# EAGLE design heat_bed_100 (EAGLE 7.2.0)
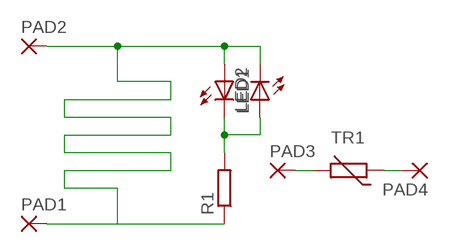
[diagram p0: schematic, sheet 1]

## Parts
LED1  LEDSML0805  [SML0805]
LED2  LEDSML0805  [SML0805]
PAD1  2,54/1,0  [2,54/1,0]
PAD2  2,54/1,0  [2,54/1,0]
PAD3  2,54/1,0  [2,54/1,0]
PAD4  2,54/1,0  [2,54/1,0]
R1  R-EU_M1206  [M1206]
TR1  THERMISTOR_R-5  [R-5]

## Nets
N$1: LED1.A LED2.C PAD1.1(P) PAD2.1(P) R1.1
N$2: PAD3.1(P) TR1.2
N$3: PAD4.1(P) TR1.1
N$4: LED1.C LED2.A R1.2

## Library data of the parts
LED1 LED2 = led:LED: LED OSRAM: - CHIPLED LG R971, LG N971, LY N971, LG Q971, LY Q971, LO R971, LY R971 LH N974, LH R974 LS Q976, LO Q976, LY Q976 LO Q996 - Hyper CHIPLED LW Q18S LB Q993, LB Q99A, LB R99A - SideLED LS A670, LO A670, LY A670, LG A670, LP A670 LB A673, LV A673, LT A673, LW A673 LH A674 LY A675 LS A676, LA A676, LO A676, LY A676, LW A676 LS A679, LY A679, LG A679 - Hyper Micro SIDELED® LS Y876, LA Y876, LO Y876, LY Y876 LT Y87S - SmartLED LW L88C, LW L88S LB L89C, LB L89S, LG L890 LS L89K, LO L89K, LY L89K LS L896, LA L896, LO L896, LY L896 - TOPLED LS T670, LO T670, LY T670, LG T670, LP T670 LSG T670, LSP T670, LSY T670, LOP T670, LYG T670 LG T671, LOG T671, LSG T671 LB T673, LV T673, LT T673, LW T673 LH T674 LS T676, LA T676, LO T676, LY T676, LB T676, LH T676, LSB T676, LW T676 LB T67C, LV T67C, LT T67C, LS T67K, LO T67K, LY T67K, LW E67C LS E67B, LA E67B, LO E67B, LY E67B, LB E67C, LV E67C, LT E67C LW T67C LS T679, LY T679, LG T679 LS T770, LO T770, LY T770, LG T770, LP T770 LB T773, LV T773, LT T773, LW T773 LH T774 LS E675, LA E675, LY E675, LS T675 LS T776, LA T776, LO T776, LY T776, LB T776 LHGB T686 LT T68C, LB T68C - Hyper Mini TOPLED® LB M676 - Mini TOPLED Santana® LG M470 LS M47K, LO M47K, LY M47K Source: http://www.osram.convergy.de LUXEON: - LUMILED® LXK2-PW12-R00, LXK2-PW12-S00, LXK2-PW14-U00, LXK2-PW14-V00 LXK2-PM12-R00, LXK2-PM12-S00, LXK2-PM14-U00 LXK2-PE12-Q00, LXK2-PE12-R00, LXK2-PE12-S00, LXK2-PE14-T00, LXK2-PE14-U00 LXK2-PB12-K00, LXK2-PB12-L00, LXK2-PB12-M00, LXK2-PB14-N00, LXK2-PB14-P00, LXK2-PB14-Q00 LXK2-PR12-L00, LXK2-PR12-M00, LXK2-PR14-Q00, LXK2-PR14-R00 LXK2-PD12-Q00, LXK2-PD12-R00, LXK2-PD12-S00 LXK2-PH12-R00, LXK2-PH12-S00 LXK2-PL12-P00, LXK2-PL12-Q00, LXK2-PL12-R00 Source: www.luxeon.com KINGBRIGHT: KA-3528ASYC Source: www.kingbright.com
PAD1-PAD4 = wirepad:2,54/1,0: THROUGH-HOLE PAD
R1 = rcl:R-EU_: RESISTOR, European symbol
TR1 = discrete:THERMISTOR_: Thermo Resistor

## Board
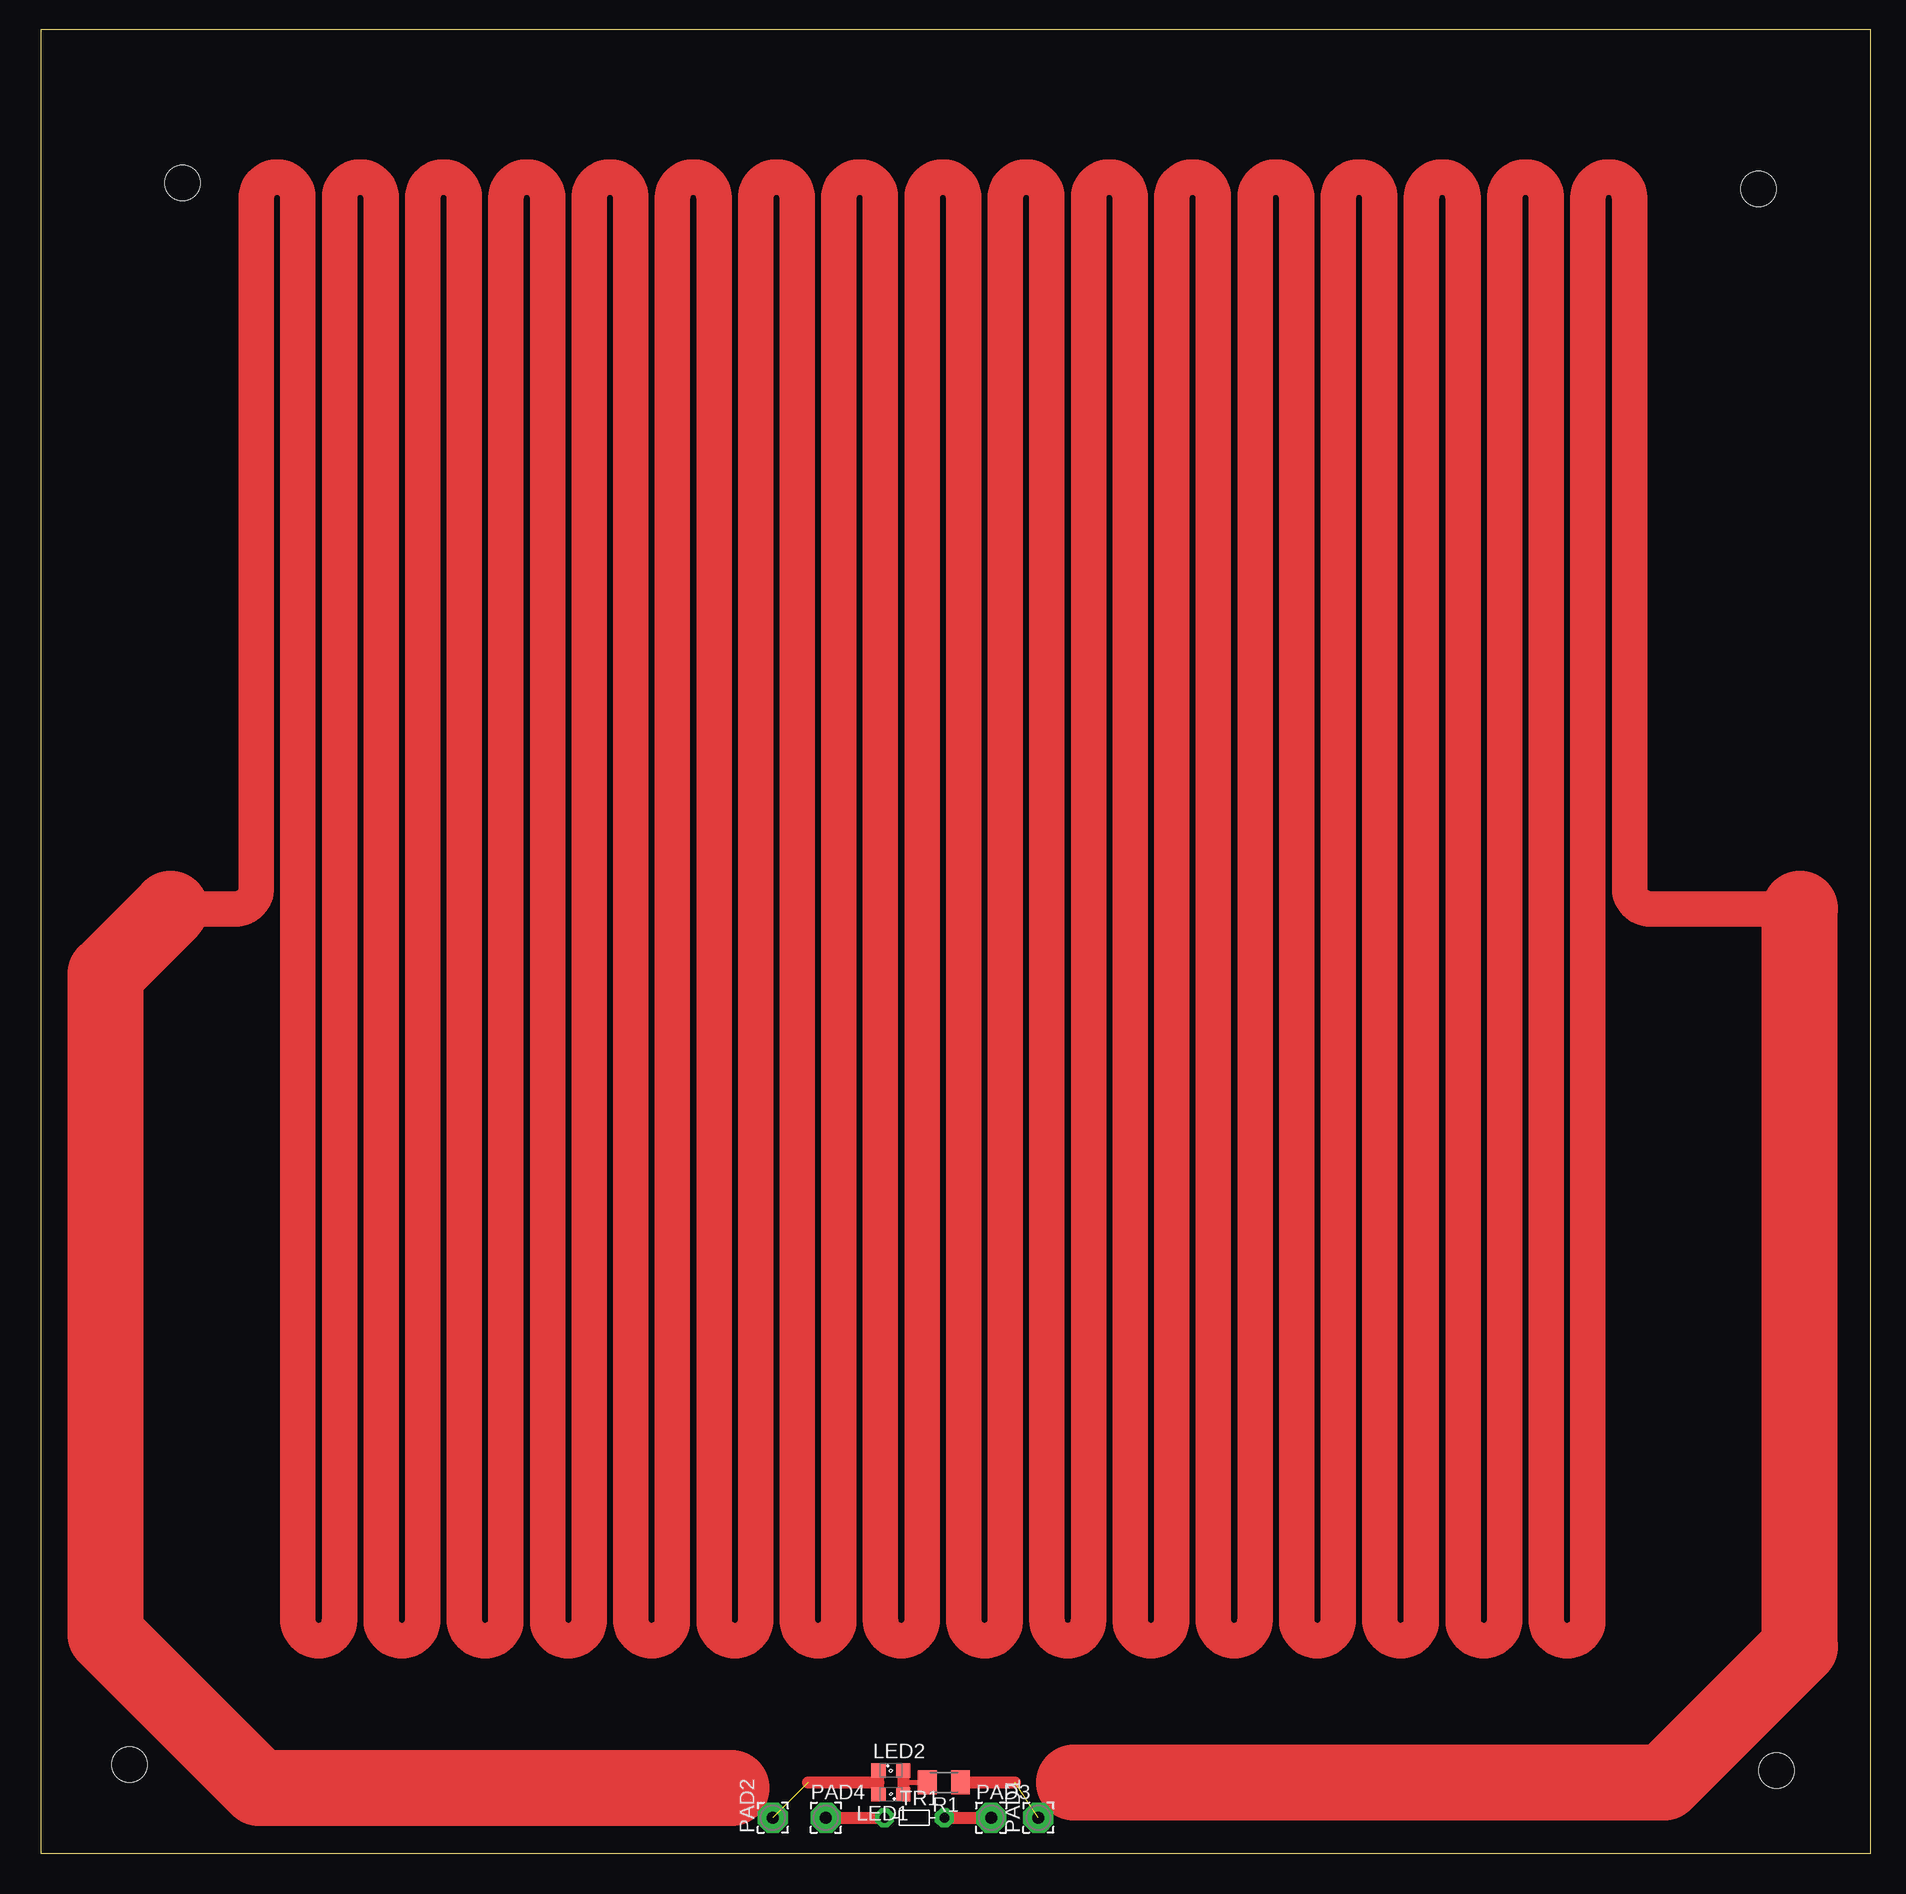
[diagram p1: board, top side]

Size 155 x 154.5 mm. Coordinates in mm from the lower left corner, seen from the top.
Outline: 0,0 155,0 155,154.5 0,154.5 0,0
Copper layers (1*16): Top 0.035mm / dielectric 1.5mm / Bottom 0.035mm
Design rules "heat_bed_100": minimum track width 10mil, minimum drill 24mil, track to track 0.205mm, track to pad 0.205mm, pad to pad 0.205mm, via to via 0.205mm, smd to smd 8mil, copper to edge 40mil, drill to drill 8mil, minimum pad ring 10mil, minimum via ring 8mil, stop-mask expansion 4mil, vias tented up to drill 0mil, thermal gap 10mil
Holes 3 mm at 7.5,7.5 147,7 145.5,141 12,141.5

### Footprints (pad centres in the part's own frame; a part is rotated, then mirrored left to right if it is on the bottom)
SML0805 = smd 1.2 x 1.2: A 1.05,0; C -1.05,0
2,54/1,0 = drill 1.016 pad 2.54 octagon: 1 0,0
M1206 = smd 1.6 x 2: 1 -1.4,0; 2 1.4,0
R-5 = drill 0.813 pad 1.6 octagon: 1 -2.54,0; 2 2.54,0

### Placement (x,y rotation side)
LED1  72,5 180 top
LED2  72,7 0 top
PAD1  84.5,3 90 top
PAD2  62,3 90 top
PAD3  80.5,3 0 top
PAD4  66.5,3 0 top
R1  76.5,6 180 top
TR1  74,3 0 top

### Tracks (layer width: path | path; a pad name or v marks a point on that pad's centre or on a via)
N$1  (2 unrouted)
  Top 1: LED1.A 70.95,6 LED2.C
  Top 1.016: 65,6 70.95,6 | R1.1 82.5,6
  Top 1.27: PAD1.1 87.5,6 | PAD2.1 58.5,5.5
  Top 3: 149,80 136.32,80 arc-90 134.57,81.76 134.57,140.24 arc90 132.81,142 132.8,142 arc90 131.04,140.24 131.04,19.76 arc-90 129.29,18 129.27,18 arc-90 127.52,19.76 127.52,140.24 arc90 125.76,142 125.75,142 arc90 123.99,140.24 123.99,19.76 arc-90 122.24,18 122.22,18 arc-90 120.47,19.76 120.47,140.24 arc90 118.71,142 118.7,142 arc90 116.94,140.24 116.94,19.76 arc-90 115.19,18 115.18,18 arc-90 113.42,19.76 113.42,140.24 arc90 111.66,142 111.65,142 arc90 109.89,140.24 109.89,19.76 arc-90 108.14,18 108.13,18 arc-90 106.37,19.76 106.37,140.24 arc90 104.61,142 104.6,142 arc90 102.85,140.24 102.85,19.76 arc-90 101.09,18 101.08,18 arc-90 99.32,19.76 99.32,140.24 arc90 97.56,142 97.55,142 arc90 95.8,140.24 95.8,19.76 arc-90 94.04,18 94.03,18 arc-90 92.27,19.76 92.27,140.24 arc90 90.52,142 90.5,142 arc90 88.75,140.24 88.75,19.76 arc-90 86.99,18 86.98,18 arc-90 85.22,19.76 85.22,140.24 arc90 83.47,142 83.45,142 arc90 81.7,140.24 81.7,19.76 arc-90 79.94,18 79.93,18 arc-90 78.17,19.76 78.17,140.24 arc90 76.42,142 76.41,142 arc90 74.65,140.24 74.65,19.76 arc-90 72.89,18 72.88,18 arc-90 71.12,19.76 71.12,140.24 arc90 69.37,142 69.36,142 arc90 67.6,140.24 67.6,19.76 arc-90 65.84,18 65.83,18 arc-90 64.08,19.76 64.08,140.24 arc90 62.32,142 62.31,142 arc90 60.55,140.24 60.55,19.76 arc-90 58.8,18 58.78,18 arc-90 57.03,19.76 57.03,140.24 arc90 55.27,142 55.26,142 arc90 53.5,140.24 53.5,19.76 arc-90 51.75,18 51.73,18 arc-90 49.98,19.76 49.98,140.24 arc90 48.22,142 48.21,142 arc90 46.45,140.24 46.45,19.76 arc-90 44.7,18 44.68,18 arc-90 42.93,19.76 42.93,140.24 arc90 41.17,142 41.16,142 arc90 39.4,140.24 39.4,19.76 arc-90 37.65,18 37.63,18 arc-90 35.88,19.76 35.88,140.24 arc90 34.12,142 34.11,142 arc90 32.35,140.24 32.35,19.76 arc-90 30.6,18 30.59,18 arc-90 28.83,19.76 28.83,140.24 arc90 27.07,142 27.06,142 arc90 25.3,140.24 25.3,19.76 arc-90 23.55,18 23.54,18 arc-90 21.78,19.76 21.78,140.24 arc90 20.02,142 20.01,142 arc90 18.26,140.24 18.26,81.76 arc-90 16.5,80 11,80
  Top 6.452: 87.5,6 137.5,6 149,17.5 149,80 | 11,80 5.5,74.5 5.5,18.5 18.5,5.5 58.5,5.5
N$2
  Top 1.016: TR1.2 PAD3.1
N$3
  Top 1.016: PAD4.1 TR1.1
N$4
  Top 0.406: LED2.A 73,6.95 73,6 R1.2
  Top 1: LED2.A LED1.C

### Text on the board
tisk: 12V 40W | 3.6R